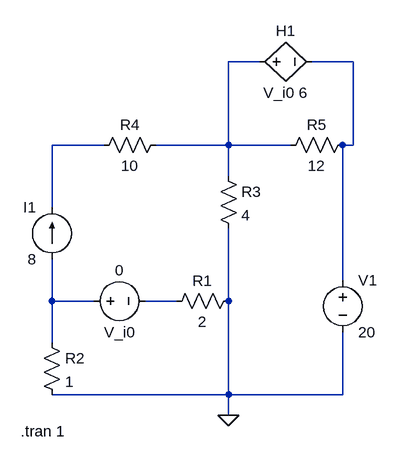
[diagram p0: schematic Ex_03_80.asc]
Ex_03_80.asc, the LTspice schematic file:
Version 4.1
SHEET 1 880 680
WIRE 192 -176 144 -176
WIRE 336 -176 272 -176
WIRE -48 -48 -128 -48
WIRE 144 -48 144 -176
WIRE 144 -48 32 -48
WIRE 240 -48 144 -48
WIRE 336 -48 336 -176
WIRE 336 -48 320 -48
WIRE 144 0 144 -48
WIRE -128 48 -128 -48
WIRE 320 160 320 -48
WIRE -128 192 -128 128
WIRE -64 192 -128 192
WIRE 64 192 16 192
WIRE 144 192 144 80
WIRE -128 256 -128 192
WIRE 144 336 144 192
WIRE 144 336 -128 336
WIRE 320 336 320 240
WIRE 320 336 144 336
WIRE 144 368 144 336
FLAG 144 368 0
SYMBOL voltage 320 144 R0
WINDOW 123 0 0 Left 0
WINDOW 39 0 0 Left 0
SYMATTR InstName V1
SYMATTR Value 20
SYMBOL res 160 176 R90
WINDOW 0 0 56 VBottom 2
WINDOW 3 32 56 VTop 2
SYMATTR InstName R1
SYMATTR Value 2
SYMBOL voltage -80 192 R270
WINDOW 0 -32 56 VBottom 2
WINDOW 3 32 56 VTop 2
WINDOW 123 0 0 Left 0
WINDOW 39 0 0 Left 0
SYMATTR InstName V_i0
SYMATTR Value 0
SYMBOL res -144 240 R0
SYMATTR InstName R2
SYMATTR Value 1
SYMBOL res 128 -16 R0
SYMATTR InstName R3
SYMATTR Value 4
SYMBOL res 48 -64 R90
WINDOW 0 0 56 VBottom 2
WINDOW 3 32 56 VTop 2
SYMATTR InstName R4
SYMATTR Value 10
SYMBOL res 336 -64 R90
WINDOW 0 0 56 VBottom 2
WINDOW 3 32 56 VTop 2
SYMATTR InstName R5
SYMATTR Value 12
SYMBOL current -128 128 R180
WINDOW 0 24 80 Left 2
WINDOW 3 24 0 Left 2
WINDOW 123 0 0 Left 0
WINDOW 39 0 0 Left 0
SYMATTR InstName I1
SYMATTR Value 8
SYMBOL h 176 -176 R270
WINDOW 0 32 56 VTop 2
WINDOW 3 -32 56 VBottom 2
SYMATTR InstName H1
SYMATTR Value V_i0 6
TEXT -176 392 Left 2 !.tran 1

The netlist it stands for:
* Ex_03_80.asc
V1 N002 0 20
R1 0 N005 2
V_i0 N004 N005 0
R2 N004 0 1
R3 N001 0 4
R4 N001 N003 10
R5 N002 N001 12
I1 N004 N003 8
H1 N001 N002 V_i0 6
.tran 1
.backanno
.end